# EAGLE design magbead_v4 (EAGLE 7.7.0)
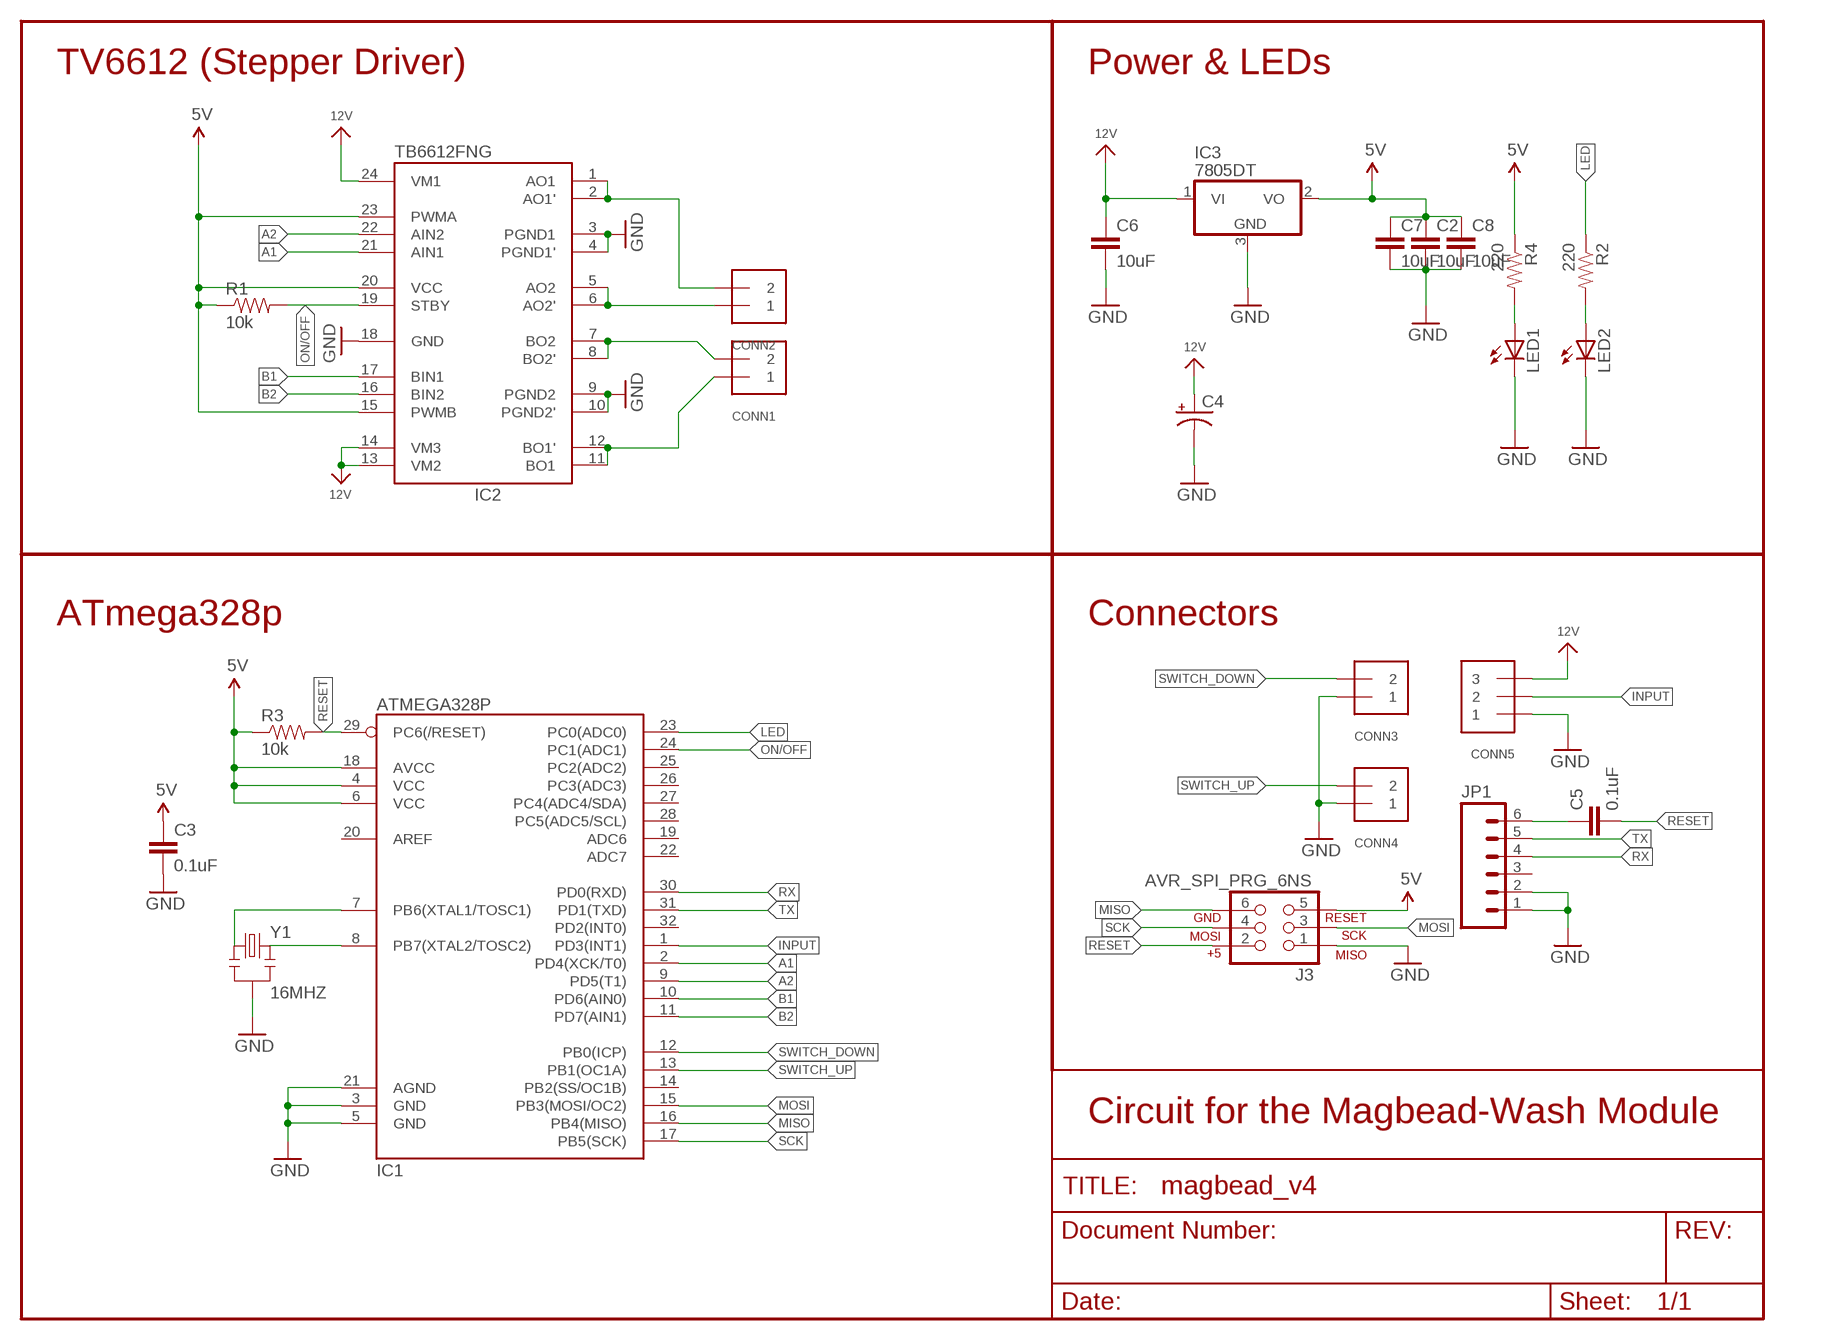
[diagram p0: schematic, sheet 1]

## Parts
C2  10uF  CAP0805  [0805]
C3  0.1uF  CAP0603-CAP  [0603-CAP]
C4  CAP_POLD  [PANASONIC_D]
C5  0.1uF  CAP0603-CAP  [0603-CAP]
C6  10uF  CAP0805  [0805]
C7  10uF  CAP0805  [0805]
C8  10uF  CAP0805  [0805]
CONN1  TERMBLOCK_1X2  [TERMBLOCK_1X2-3.5MM]
CONN2  TERMBLOCK_1X2  [TERMBLOCK_1X2-3.5MM]
CONN3  TERMBLOCK_1X2  [TERMBLOCK_1X2-3.5MM]
CONN4  TERMBLOCK_1X2  [TERMBLOCK_1X2-3.5MM]
CONN5  TERMBLOCK_1X3  [TERMBLOCK_1X3-3.5MM]
IC1  ATMEGA328P  ATMEGA328_SMT  [TQFP32-08]
IC2  TB6612FNG  [SSOP24]
IC3  7805DT  [TO252]
J3  AVR_SPI_PRG_6NS  [2X3-NS]
JP1  M06SIP  [1X06]
LED1  LEDCHIP-LED0603  [CHIP-LED0603]
LED2  LEDCHIP-LED0603  [CHIP-LED0603]
R1  10k  RESISTOR0603-RES  [0603-RES]
R2  220  RESISTOR0603-RES  [0603-RES]
R3  10k  RESISTOR0603-RES  [0603-RES]
R4  220  RESISTOR0603-RES  [0603-RES]
Y1  16MHZ  RESONATOR16MHZ  [RESONATOR-SMD]

## Nets
5V: C2.1 C3.1 C7.1 C8.1 IC1.4(VCC) IC1.6(VCC) IC1.18(AVCC) IC2.15(PWMB) IC2.20(VCC) IC2.23(PWMA) IC3.2(VO) J3.5 R1.1 R3.1 R4.1
12V: C4.+ C6.1 CONN5.3 IC2.13(VM2) IC2.14(VM3) IC2.24(VM1) IC3.1(VI)
A1: IC1.2(PD4(XCK/T0)) IC2.21(AIN1)
A2: IC1.9(PD5(T1)) IC2.22(AIN2)
B1: IC1.10(PD6(AIN0)) IC2.17(BIN1)
B2: IC1.11(PD7(AIN1)) IC2.16(BIN2)
GND: C2.2 C3.2 C4.- C6.2 C7.2 C8.2 CONN3.1 CONN4.1 CONN5.1 IC1.3(GND) IC1.5(GND) IC1.21(AGND) IC2.3(PGND1) IC2.4(PGND1') IC2.9(PGND2) IC2.10(PGND2') IC2.18(GND) IC3.3(GND) J3.1 JP1.1 JP1.2 LED1.C LED2.C Y1.2
INPUT: CONN5.2 IC1.1(PD3(INT1))
LED: IC1.23(PC0(ADC0)) R2.1
MISO: IC1.16(PB4(MISO)) J3.6
MOSI: IC1.15(PB3(MOSI/OC2)) J3.3
N$1: LED2.A R2.2
N$2: CONN2.2 IC2.1(AO1) IC2.2(AO1')
N$3: LED1.A R4.2
N$4: IC1.8(PB7(XTAL2/TOSC2)) Y1.3
N$5: IC1.7(PB6(XTAL1/TOSC1)) Y1.1
N$7: C5.1 JP1.6
N$14: CONN2.1 IC2.5(AO2) IC2.6(AO2')
N$15: CONN1.2 IC2.7(BO2) IC2.8(BO2')
N$17: CONN1.1 IC2.11(BO1) IC2.12(BO1')
ON/OFF: IC1.24(PC1(ADC1)) IC2.19(STBY) R1.2
RESET: C5.2 IC1.29(PC6(/RESET)) J3.2 R3.2
RX: IC1.30(PD0(RXD)) JP1.4
SCK: IC1.17(PB5(SCK)) J3.4
SWITCH_DOWN: CONN3.2 IC1.12(PB0(ICP))
SWITCH_UP: CONN4.2 IC1.13(PB1(OC1A))
TX: IC1.31(PD1(TXD)) JP1.5
Unconnected: IC1.14(PB2(SS/OC1B)) IC1.19(ADC6) IC1.20(AREF) IC1.22(ADC7) IC1.25(PC2(ADC2)) IC1.26(PC3(ADC3)) IC1.27(PC4(ADC4/SDA)) IC1.28(PC5(ADC5/SCL)) IC1.32(PD2(INT0)) JP1.3

## Notes on the sheet
- TV6612 (Stepper Driver) | Power & LEDs
- ATmega328p | Connectors
- Circuit for the Magbead-Wash Module

## Library data of the parts
C2 C3 C5-C8 = SparkFun:CAP: Capacitor Standard 0603 ceramic capacitor, and 0.1" leaded capacitor.
C4 = SparkFun:CAP_POL: Capacitor Polarized These are standard SMD and PTH capacitors. Normally 10uF, 47uF, and 100uF in electrolytic and tantalum varieties. Always verify the external diameter of the through hole cap, it varies with capacity, voltage, and manufacturer. The EIA devices should be standard.
CONN1-CONN4 = microbuilder:TERMBLOCK_1X2: 3.5mm Terminal block http://www.ladyada.net/library/pcb/eaglelibrary.html
CONN5 = microbuilder:TERMBLOCK_1X3: 3.5mm Terminal block http://www.ladyada.net/library/pcb/eaglelibrary.html
IC1 = SparkFun-DigitalIC:ATMEGA328_SMT: 32-Pin Atmega328 part Commonly used on Arduino compatible boards Available in QFP and QFN packages TQFP is IC-09069 QFN is non-stock; PROD_ID: IC-09069
IC2 = adafruit:TB6612FNG: TB6612FNG MOS dual H-bridge motor driver, 1.2A current 3.2A peak 3 or 5v logic and 3-15v motor
IC3 = adafruit:78*: Positive VOLTAGE REGULATOR Added bigger pads to the TO-92 package
J3 = SparkFun:AVR_SPI_PRG_6: AVR ISP 6 Pin This is the reduced ISP connector for AVR programming. Common on Arduino. This footprint will take up less PCB space and can be used with a 10-pin to 6-pin adapter such as SKU: BOB-08508
JP1 = SparkFun:M06: Header 6 Standard 6-pin 0.1" header. Use with straight break away headers (SKU : PRT-00116), right angle break away headers (PRT-00553), swiss pins (PRT-00743), machine pins (PRT-00117), and female headers (PRT-00115). Molex polarized connector foot print use with SKU : PRT-08094 with associated crimp pins and housings. NOTES ON THE VARIANTS LOCK and LOCK_LONGPADS... This footprint was designed to help hold the alignment of a through-hole component (i.e. 6-pin header) while soldering it into place. You may notice that each hole has been shifted either up or down by 0.005 of an inch from it's more standard position (which is a perfectly straight line). This slight alteration caused the pins (the squares in the middle) to touch the edges of the holes. Because they are alternating, it causes a "brace" to hold the component in place. 0.005 has proven to be the perfect amount of "off-center" position when using our standard breakaway headers. Although looks a little odd when you look at the bare footprint, once you have a header in there, the alteration is very hard to notice. Also, if you push a header all the way into place, it is covered up entirely on the bottom side. This idea of altering the position of holes to aid alignment will be further integrated into the Sparkfun Library for other footprints. It can help hold any component with 3 or more connection pins.
LED1 LED2 = adafruit:LED: LED OSRAM: - CHIPLED LG R971, LG N971, LY N971, LG Q971, LY Q971, LO R971, LY R971 LH N974, LH R974 LS Q976, LO Q976, LY Q976 LO Q996 - Hyper CHIPLED LW Q18S LB Q993, LB Q99A, LB R99A - SideLED LS A670, LO A670, LY A670, LG A670, LP A670 LB A673, LV A673, LT A673, LW A673 LH A674 LY A675 LS A676, LA A676, LO A676, LY A676, LW A676 LS A679, LY A679, LG A679 - Hyper Micro SIDELED® LS Y876, LA Y876, LO Y876, LY Y876 LT Y87S - SmartLED LW L88C, LW L88S LB L89C, LB L89S, LG L890 LS L89K, LO L89K, LY L89K LS L896, LA L896, LO L896, LY L896 - TOPLED LS T670, LO T670, LY T670, LG T670, LP T670 LSG T670, LSP T670, LSY T670, LOP T670, LYG T670 LG T671, LOG T671, LSG T671 LB T673, LV T673, LT T673, LW T673 LH T674 LS T676, LA T676, LO T676, LY T676, LB T676, LH T676, LSB T676, LW T676 LB T67C, LV T67C, LT T67C, LS T67K, LO T67K, LY T67K, LW E67C LS E67B, LA E67B, LO E67B, LY E67B, LB E67C, LV E67C, LT E67C LW T67C LS T679, LY T679, LG T679 LS T770, LO T770, LY T770, LG T770, LP T770 LB T773, LV T773, LT T773, LW T773 LH T774 LS E675, LA E675, LY E675, LS T675 LS T776, LA T776, LO T776, LY T776, LB T776 LHGB T686 LT T68C, LB T68C - Hyper Mini TOPLED® LB M676 - Mini TOPLED Santana® LG M470 LS M47K, LO M47K, LY M47K Source: http://www.osram.convergy.de/
R1-R4 = SparkFun-Passives:RESISTOR: Resistor Basic schematic elements and footprints for 0603, 1206, and PTH resistors.
Y1 = SparkFun-FreqCtrl:RESONATOR: Resonator Small SMD resonator. Used, eg, on the Arduino Pro/ Pro Mini boards. 8MHz- XTAL-08895 16MHz- XTAL-08900; PROD_ID: XTAL-08900

## Board
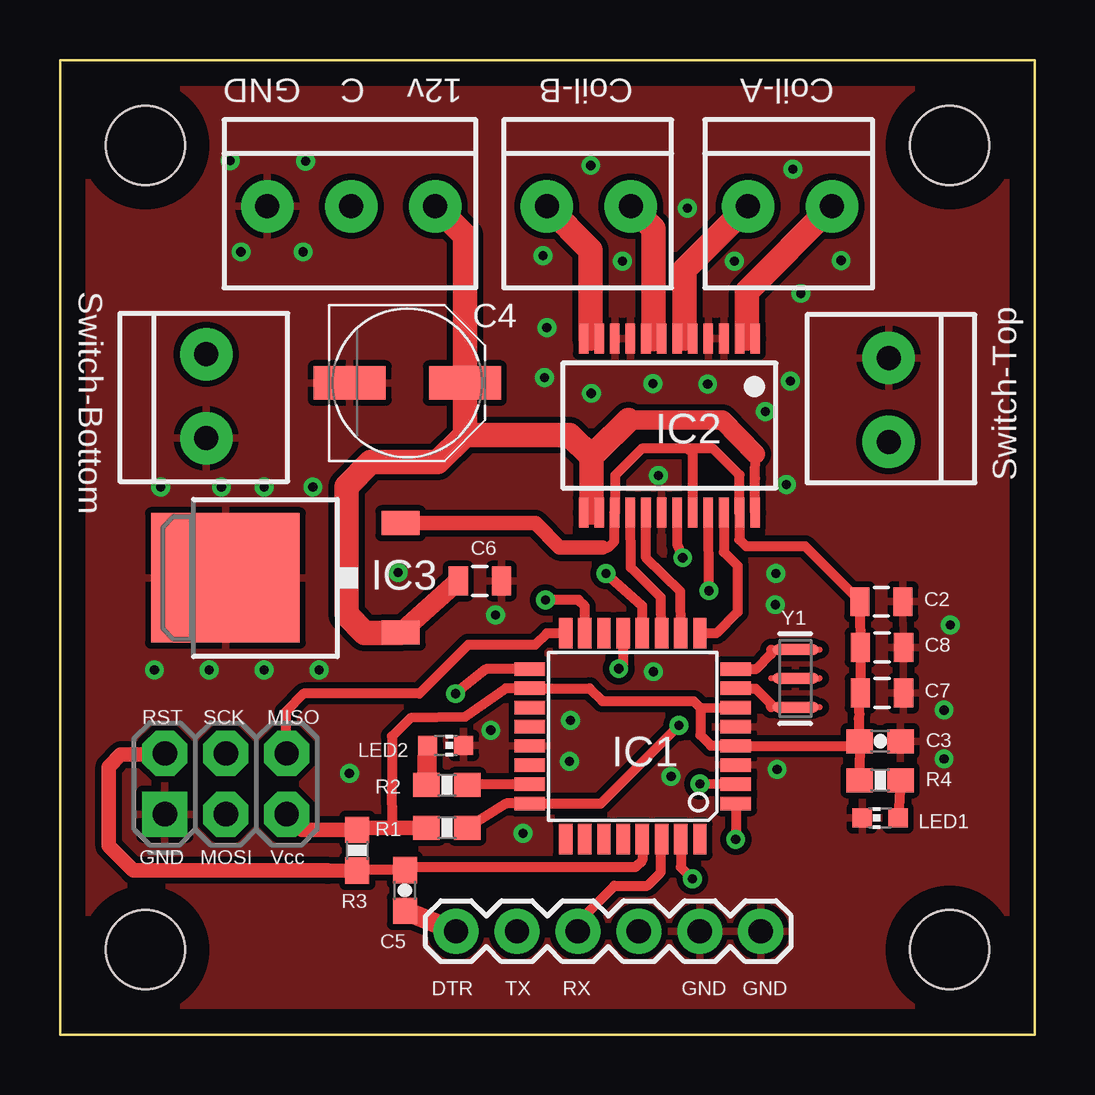
[diagram p1: board, top side]
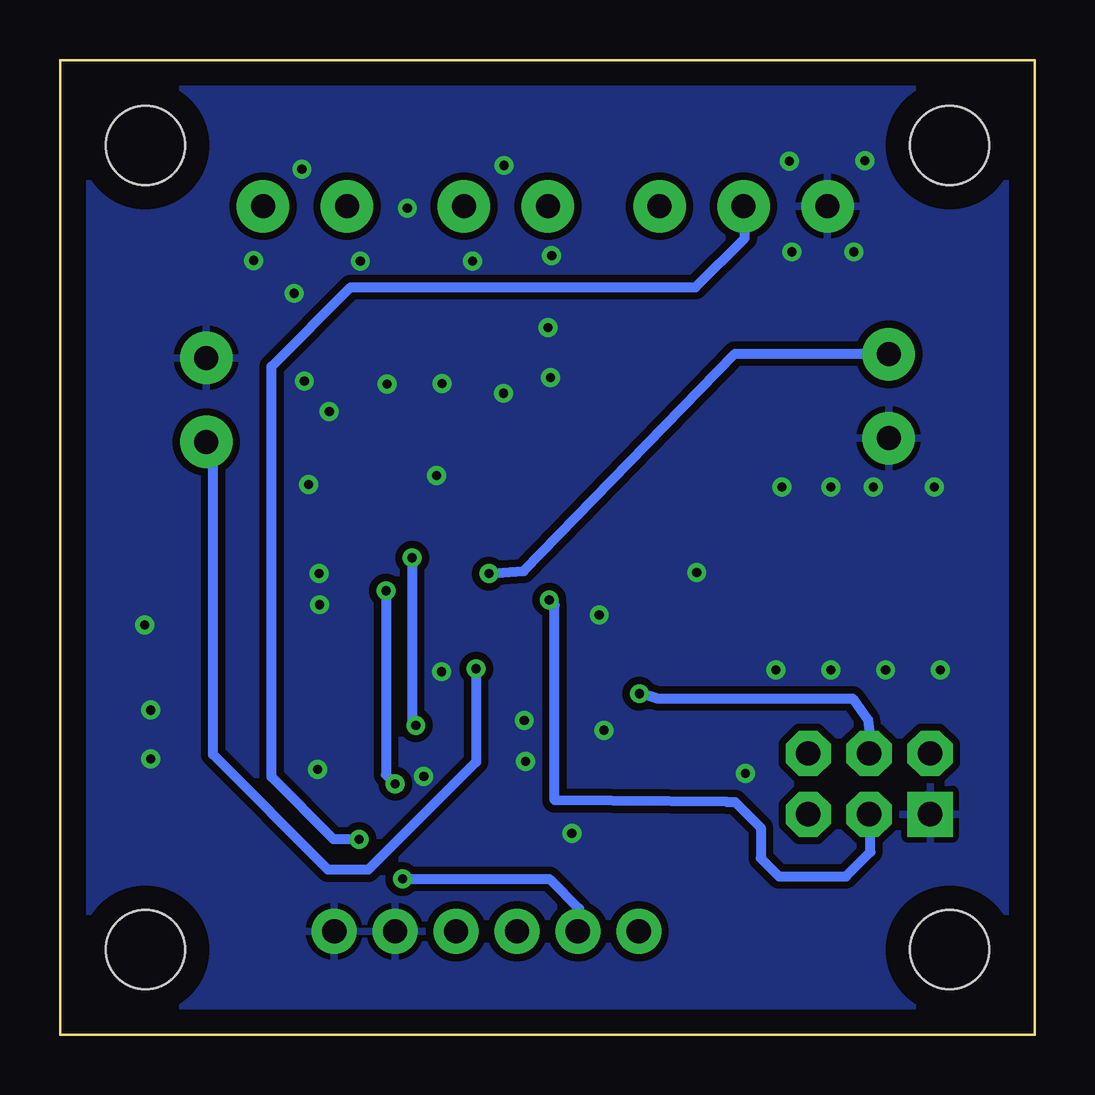
[diagram p2: board, bottom side, seen from below]

Size 40.64 x 40.64 mm. Coordinates in mm from the lower left corner, seen from the top.
Outline: 0,40.64 40.64,40.64 40.64,0 0,0 0,40.64
Copper layers (1*16): Top 0.035mm / dielectric 1.5mm / Bottom 0.035mm
Design rules "default *": minimum track width 10mil, minimum drill 10mil, track to track 8mil, track to pad 8mil, pad to pad 8mil, via to via 8mil, smd to smd 8mil, copper to edge 40mil, drill to drill 8mil, minimum pad ring 10mil, minimum via ring 8mil, stop-mask expansion 4mil, vias tented up to drill 20mil, thermal gap 10mil
Holes 3.3 mm at 37.08,37.08 3.56,37.08 37.08,3.56 3.56,3.56

### Footprints (pad centres in the part's own frame; a part is rotated, then mirrored left to right if it is on the bottom)
0805 = smd 0.8 x 1.2: 1 -0.9,0; 2 0.9,0
0603-CAP = smd 1.1 x 1: 1 -0.85,0; 2 0.85,0
PANASONIC_D = smd 3 x 1.4: + 2.4,0; - -2.4,0
TERMBLOCK_1X2-3.5MM = drill 1 pad 2.184: 1 1.8,0; 2 -1.7,0
TERMBLOCK_1X3-3.5MM = drill 1 pad 2.184: 1 3.55,0; 2 0.05,0; 3 -3.45,0
TQFP32-08 = smd 1.27 x 0.559: 1 -4.293,2.8; 2 -4.293,2; 3 -4.293,1.2; 4 -4.293,0.4; 5 -4.293,-0.4; 6 -4.293,-1.2; 7 -4.293,-2; 8 -4.293,-2.8; 17 4.293,-2.8; 18 4.293,-2; 19 4.293,-1.2; 20 4.293,-0.4; 21 4.293,0.4; 22 4.293,1.2; 23 4.293,2; 24 4.293,2.8 | smd 0.559 x 1.27: 9 -2.8,-4.293; 10 -2,-4.293; 11 -1.2,-4.293; 12 -0.4,-4.293; 13 0.4,-4.293; 14 1.2,-4.293; 15 2,-4.293; 16 2.8,-4.293; 25 2.8,4.293; 26 2,4.293; 27 1.2,4.293; 28 0.4,4.293; 29 -0.4,4.293; 30 -1.2,4.293; 31 -2,4.293; 32 -2.8,4.293
SSOP24 = smd 0.4 x 1.25: 1 -3.575,-3.625; 2 -2.925,-3.625; 3 -2.275,-3.625; 4 -1.625,-3.625; 5 -0.975,-3.625; 6 -0.325,-3.625; 7 0.325,-3.625; 8 0.975,-3.625; 9 1.625,-3.625; 10 2.275,-3.625; 11 2.925,-3.625; 12 3.575,-3.625; 13 3.575,3.625; 14 2.925,3.625; 15 2.275,3.625; 16 1.625,3.625; 17 0.975,3.625; 18 0.325,3.625; 19 -0.325,3.625; 20 -0.975,3.625; 21 -1.625,3.625; 22 -2.275,3.625; 23 -2.925,3.625; 24 -3.575,3.625
TO252 = smd 1 x 1.6: 1 -2.28,-4.8; 2 2.28,-4.8 | smd 5.4 x 6.2: 3 0,2.5
2X3-NS = drill 1.016 pad 1.88 square: 1 -2.54,-1.27 | drill 1.016 pad 1.88 octagon: 2 -2.54,1.27; 3 0,-1.27; 4 0,1.27; 5 2.54,-1.27; 6 2.54,1.27
1X06 = drill 1.016 pad 1.88: 1 0,0; 2 2.54,0; 3 5.08,0; 4 7.62,0; 5 10.16,0; 6 12.7,0
CHIP-LED0603 = smd 0.8 x 0.8: A 0,-0.75; C 0,0.75
0603-RES = smd 1.1 x 1: 1 -0.85,0; 2 0.85,0
RESONATOR-SMD = smd 0.45 x 1.905: 1 -1.2,0; 2 0,0; 3 1.2,0

### Placement (x,y rotation side)
C2  34.24,18.06 0 top
C3  34.19,12.24 0 top
C4  14.48,27.18 0 top
C5  14.38,6.02 90 top
C6  17.5,18.92 0 top
C7  34.26,14.25 0 top
C8  34.26,16.15 0 top
CONN1  22.1,34.54 180 top
CONN2  30.48,34.54 180 top
CONN3  6.1,26.67 270 top
CONN4  34.54,26.42 90 top
CONN5  12.19,34.54 180 top
IC1  23.88,12.45 180 top
IC2  25.4,25.4 180 top
IC3  9.4,19.05 90 top
J3  6.91,10.46 0 top
JP1  29.21,4.32 180 top
LED1  34.19,9.04 90 top
LED2  16.08,12.06 270 top
R1  16.13,8.64 0 top
R2  16.13,10.41 180 top
R3  12.4,7.7 270 top
R4  34.19,10.62 0 top
Y1  30.66,14.86 90 top

### Tracks (layer width: path | path; a pad name or v marks a point on that pad's centre or on a via)
5V
  Top 0.406: 26.7,13.64 IC1.6 | C3.1 33.33,10.88 R4.1 | 26.7,13.64 26.42,13.92 22.61,13.92 22.08,14.45 IC1.18 18.59,14.45 16.89,13.26 14.61,13.21 13.84,12.45 13.84,10.46 13.86,8.68 12.46,8.64 | 26.7,13.64 26.7,12.5 27.13,12.06 28.15,12.06 IC1.4 32.86,12.05 C3.1 | 26.19,24.43 27.23,24.43 28.32,23.34 IC2.23 28.32,20.65 28.6,20.37 31.05,20.37 33.34,18.09 C2.1 33.34,17.73 C8.1 C7.1 33.31,14.2 33.31,13.45 33.3,13.18 33.3,12.26 C3.1 | 26.19,24.43 24.26,24.43 23.14,23.32 23.14,21.79 IC2.15 23.11,20.57 22.86,20.32 22.61,20.32 | IC2.20 26.38,24.25 26.19,24.43
  Top 0.61: R1.1 12.46,8.64 R3.1 10.1,8.55 J3.5 | IC3.2 19.82,21.33 20.83,20.32 22.61,20.32
12V
  Top 0.406: IC2.24 28.98,23.2 28.98,24.21 | IC2.14 IC2.13 22.14,21.77 22.15,21.77
  Top 0.813: 28.98,24.21 27.61,25.63 23.7,25.63 | C6.1 14.31,16.89 IC3.1
  Top 1.016: CONN5.3 16.88,33.31 C4.+ 16.88,25.01 | 23.7,25.63 22.38,24.33 22.15,24.11 | 22.15,21.77 22.15,24.11 | 16.88,25.01 15.75,23.88 12.95,23.88 11.94,22.86 11.94,17.53 12.7,16.76 IC3.1 | 16.88,25.01 21.25,25.01 22.15,24.11
A1  (via drill 0.38)
  Top 0.406: IC1.2 v26.67,10.46 | v27.05,18.52 IC2.21
  Bottom 0.406: v27.05,18.52 27.05,10.85 v26.67,10.46
A2
  Top 0.406: IC2.22 27.68,20.13 28.25,19.56 28.25,17.63 27.36,16.74 IC1.9
B1
  Top 0.406: IC1.10 25.86,18.49 24.43,19.89 IC2.17
B2
  Top 0.406: IC1.11 25.04,18.24 23.8,19.48 IC2.16
GND  (via drill 0.38)
  other vias: 29.41,25.98 27,27.13 20.19,27.41 24.71,27.15 22.15,26.75 24.94,23.32 21.23,11.4 19.3,8.41 25.48,10.77 29.9,11.07 36.86,13.54 29.82,17.93 29.84,19.23 17.96,12.7 30.28,22.94 20.14,32.49 20.29,29.49 22.12,36.25 26.16,34.47 30.56,36.09 32.56,32.28 30.89,30.91 30.45,27.25 7.54,32.64 10.13,32.64 10.24,36.42 7.09,36.45 21.29,13.11 24.74,15.14 28.12,32.26 23.44,32.26 18.16,17.5 14.1,19.28 3.94,15.21 6.22,15.21 8.51,15.21 10.79,15.21 10.54,22.83 8.51,22.83 6.73,22.83 4.19,22.83 37.11,17.09 36.86,11.51 12.06,10.9
  pour Bottom (isolate 0.305): 41.91,41.91 41.91,-1.27 -1.27,-1.27 -1.27,41.91
  pour Top (isolate 0.254): 40.64,40.64 40.64,0 0,0 0,40.64
INPUT  (via drill 0.38)
  Top 0.406: IC1.1 v28.17,8.15
  Bottom 0.406: v28.17,8.15 29.23,8.15 31.83,10.74 31.83,27.86 28.52,31.17 14.15,31.17 12.09,33.22 12.09,34.49 CONN5.2
LED
  Top 0.406: IC1.23 17.29,10.45 17.35,10.57 R2.1
MISO
  Top 0.406: IC1.16 20.3,16.74 19.81,16.26 17.02,16.26 14.99,14.22 10.16,14.22 9.4,13.46 9.4,12.29 J3.6
MOSI  (via drill 0.38)
  Top 0.406: IC1.15 21.88,17.88 21.61,18.14 v20.24,18.14
  Bottom 0.406: v20.24,18.14 20.02,17.91 20.02,9.78 12.83,9.7 12.5,9.7 11.43,8.64 11.43,7.37 10.67,6.6 7.87,6.6 6.86,7.62 6.86,8.64 J3.3
N$1
  Top 0.813: LED2.A R2.2
N$2
  Top 0.406: IC2.2 IC2.1 28.63,29.02 28.63,29.03
  Top 1.016: 28.63,29.03 28.63,30.99 CONN2.2
N$3
  Top 0.406: R4.2 LED1.A
N$4
  Top 0.406: 29.64,16.06 29.64,15.88 29.01,15.24 IC1.8
N$5
  Top 0.406: 29.64,13.66 29.64,13.79 29.01,14.43 28.19,14.43 IC1.7
N$7
  Top 0.813: C5.1 JP1.6
N$14
  Top 0.406: IC2.6 IC2.5 26.04,29.02 26.04,29.03
  Top 1.016: 26.04,29.03 26.04,31.9 CONN2.1
N$15
  Top 0.406: IC2.7 IC2.8 24.74,29.01
  Top 1.016: 24.74,29.01 24.74,33.6 CONN1.2
N$17
  Top 0.406: IC2.11 IC2.12 22.12,29.02 22.12,29.03
  Top 1.016: 22.12,29.03 22.12,32.72 CONN1.1
ON/OFF  (via drill 0.38)
  Top 0.406: v25.81,12.9 22.55,9.65 IC1.24 18.6,9.65 R1.2 | IC2.19 25.73,20.45 v25.96,19.89
  Bottom 0.406: v25.96,19.89 25.96,13.06 v25.81,12.9
RESET
  Top 0.406: IC1.29 24.28,7.28 23.98,6.99 14.49,6.99 C5.2 12.63,6.87 R3.2 11.93,6.85
  Top 0.61: 11.93,6.85 11.18,6.86 3.05,6.86 2.03,7.87 2.03,11.18 2.54,11.68 4.32,11.68 J3.2
RX
  Top 0.406: JP1.4 21.59,4.7 23.11,6.22 24.49,6.22 25.04,6.78 25.04,8.12 IC1.30
SCK  (via drill 0.38)
  Top 0.406: IC1.17 17.76,15.25 v16.48,14.22
  Bottom 0.406: v16.48,14.22 16.48,14.28 15.72,14.02 7.59,14.02 6.96,13.13 6.78,11.71 J3.4
SWITCH_DOWN  (via drill 0.38)
  Top 0.406: IC1.12 24.28,17.89 v22.76,19.23
  Bottom 0.406: v22.76,19.23 21.31,19.33 12.5,28.4 6.12,28.4 CONN3.2
SWITCH_UP  (via drill 0.38)
  Top 0.406: IC1.13 23.48,15.45 v23.29,15.27
  Bottom 0.406: v23.29,15.27 23.29,11.38 27.79,6.88 29.46,6.88 34.27,11.68 34.27,24.44 CONN4.2
TX  (via drill 0.38)
  Top 0.406: IC1.31 25.88,6.99 v26.36,6.5
  Bottom 0.406: v26.36,6.5 20.24,6.5 19,5.26 19,4.37 JP1.5

### Text on the board
tNames: GND | C | 12v | Coil-B | Coil-A | Switch-Bottom | Switch-Top | RST | SCK | MISO | GND | MOSI | Vcc | DTR | TX | RX | GND | GND